# EAGLE design drv8353 based bldc power stage (EAGLE 9.5.0)

## Sheet 1 of 3: Gate Driver & Signal Headers
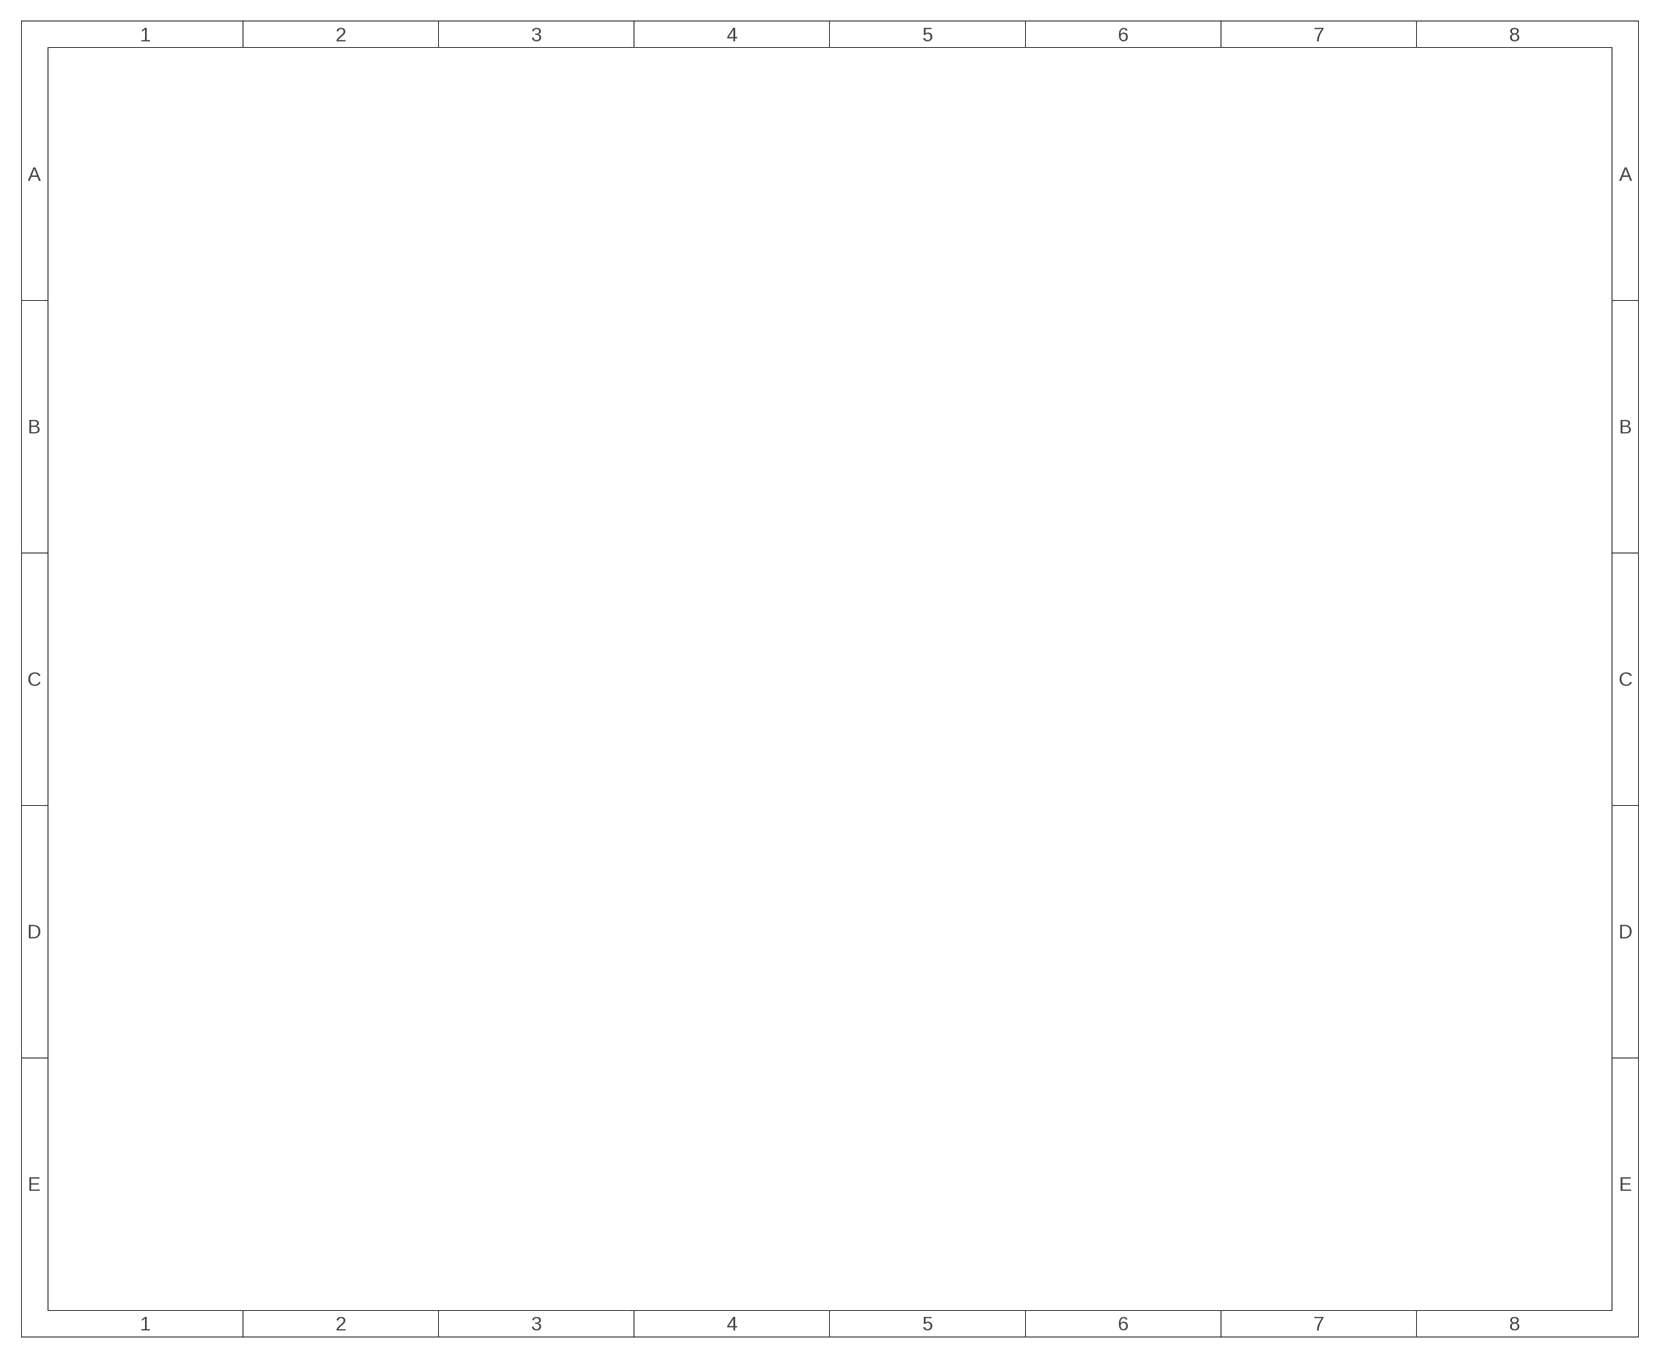
[diagram p0: schematic, sheet 1]

## Sheet 2 of 3: Half Bridges
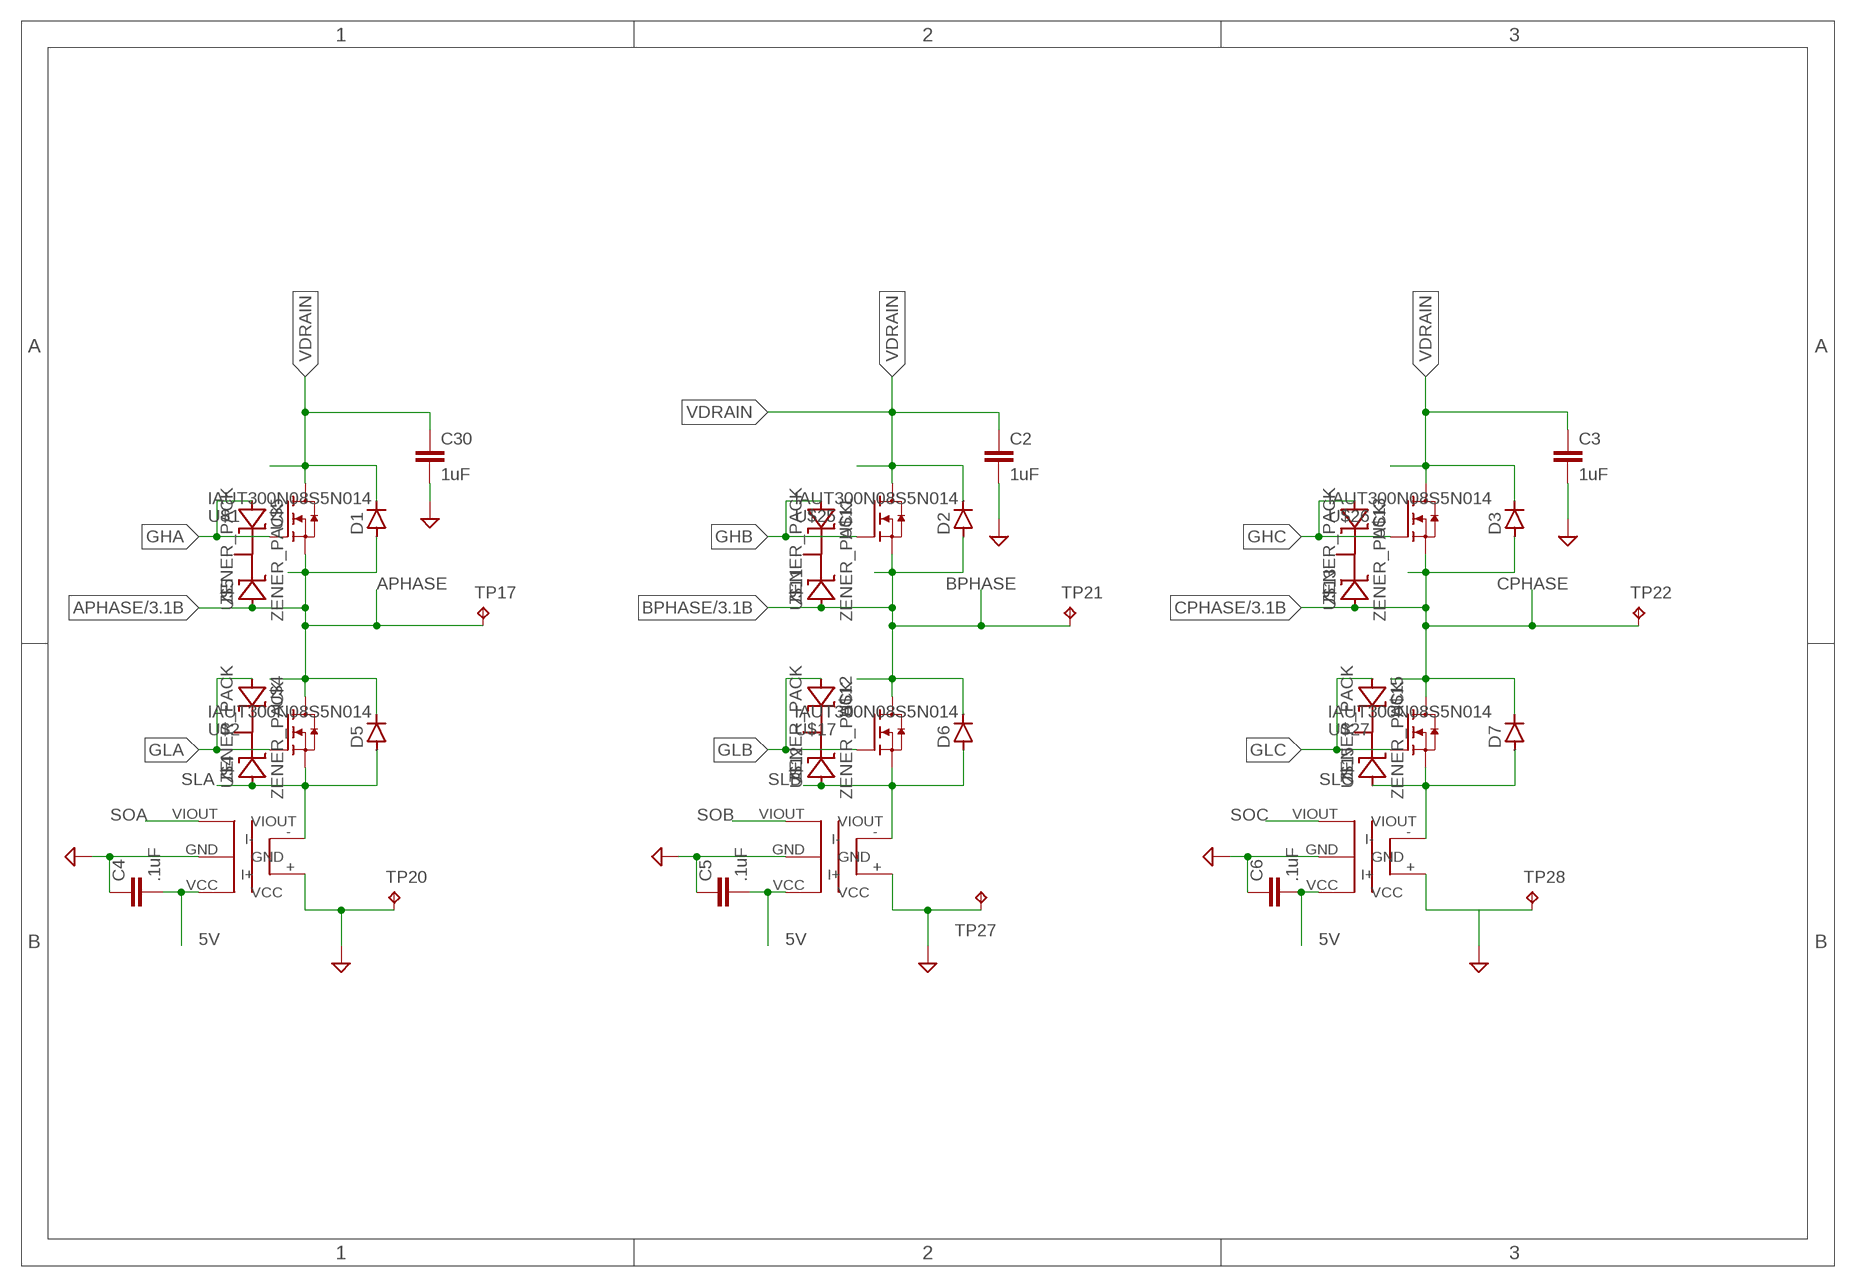
[diagram p1: schematic, sheet 2]

### Parts
C2  1uF  C-EUC1206  [C1206]
C3  1uF  C-EUC1206  [C1206]
C4  .1uF  C-EUC0603K  [C0603K]
C5  .1uF  C-EUC0603K  [C0603K]
C6  .1uF  C-EUC0603K  [C0603K]
C30  1uF  C-EUC1206  [C1206]
D1  D-SOD123  [SOD123]
D2  D-SOD123  [SOD123]
D3  D-SOD123  [SOD123]
D5  D-SOD123  [SOD123]
D6  D-SOD123  [SOD123]
D7  D-SOD123  [SOD123]
TP17  TPB1,27  [B1,27]
TP20  TPB1,27  [B1,27]
TP21  TPB1,27  [B1,27]
TP22  TPB1,27  [B1,27]
TP27  TPB1,27  [B1,27]
TP28  TPB1,27  [B1,27]
U$1  IAUT300N08S5N014  [PG-HSOF-8-1_MODIFIED]
U$2  IAUT300N08S5N014  [PG-HSOF-8-1_MODIFIED]
U$3  ACS770LCB-050B-PFF-T  [LEADFORM_PFF]
U$4  ZENER_PACK  [SOT23]
U$5  ZENER_PACK  [SOT23]
U$9  ACS770LCB-050B-PFF-T  [LEADFORM_PFF]
U$10  ACS770LCB-050B-PFF-T  [LEADFORM_PFF]
U$11  ZENER_PACK  [SOT23]
U$12  ZENER_PACK  [SOT23]
U$13  ZENER_PACK  [SOT23]
U$15  ZENER_PACK  [SOT23]
U$17  IAUT300N08S5N014  [PG-HSOF-8-1_MODIFIED]
U$25  IAUT300N08S5N014  [PG-HSOF-8-1_MODIFIED]
U$26  IAUT300N08S5N014  [PG-HSOF-8-1_MODIFIED]
U$27  IAUT300N08S5N014  [PG-HSOF-8-1_MODIFIED]

### Nets
5V: C4.2 C5.2 C6.2 U$3.VCC U$9.VCC U$10.VCC ; also sheet 3
APHASE: D1.2(A) D5.LINE(C) TP17.TP U$1.2(S) U$1.3(S) U$1.4(S) U$1.5(S) U$1.6(S) U$1.7(S) U$1.8(S) U$1.10(S) U$1.11(S) U$1.12(S) U$1.13(S) U$1.14(S) U$1.15(S) U$2.9(D) U$2.16(D) U$2.17(D) U$2.18(D) U$2.19(D) U$5.1(END1) ; also sheet 3
BPHASE: D2.2(A) D6.LINE(C) TP21.TP U$11.1(END1) U$17.9(D) U$17.16(D) U$17.17(D) U$17.18(D) U$17.19(D) U$25.2(S) U$25.3(S) U$25.4(S) U$25.5(S) U$25.6(S) U$25.7(S) U$25.8(S) U$25.10(S) U$25.11(S) U$25.12(S) U$25.13(S) U$25.14(S) U$25.15(S) ; also sheet 3
CPHASE: D3.2(A) D7.LINE(C) TP22.TP U$13.1(END1) U$26.2(S) U$26.3(S) U$26.4(S) U$26.5(S) U$26.6(S) U$26.7(S) U$26.8(S) U$26.10(S) U$26.11(S) U$26.12(S) U$26.13(S) U$26.14(S) U$26.15(S) U$27.9(D) U$27.16(D) U$27.17(D) U$27.18(D) U$27.19(D) ; also sheet 3
GHA: U$1.1(G) U$5.2(END2) ; also sheet 3
GHB: U$11.2(END2) U$25.1(G) ; also sheet 3
GHC: U$13.2(END2) U$26.1(G) ; also sheet 3
GLA: U$2.1(G) U$4.2(END2) ; also sheet 3
GLB: U$12.2(END2) U$17.1(G) ; also sheet 3
GLC: U$15.2(END2) U$27.1(G) ; also sheet 3
GND: C2.2 C3.2 C4.1 C5.1 C6.1 C30.2 TP20.TP TP27.TP TP28.TP U$3.+(I+) U$3.GND U$9.+(I+) U$9.GND U$10.+(I+) U$10.GND ; also sheet 3
SLA: D5.2(A) U$2.2(S) U$2.3(S) U$2.4(S) U$2.5(S) U$2.6(S) U$2.7(S) U$2.8(S) U$2.10(S) U$2.11(S) U$2.12(S) U$2.13(S) U$2.14(S) U$2.15(S) U$3.-(I-) U$4.1(END1) ; also sheet 3
SLB: D6.2(A) U$9.-(I-) U$12.1(END1) U$17.2(S) U$17.3(S) U$17.4(S) U$17.5(S) U$17.6(S) U$17.7(S) U$17.8(S) U$17.10(S) U$17.11(S) U$17.12(S) U$17.13(S) U$17.14(S) U$17.15(S) ; also sheet 3
SLC: D7.2(A) U$10.-(I-) U$15.1(END1) U$27.2(S) U$27.3(S) U$27.4(S) U$27.5(S) U$27.6(S) U$27.7(S) U$27.8(S) U$27.10(S) U$27.11(S) U$27.12(S) U$27.13(S) U$27.14(S) U$27.15(S) ; also sheet 3
SOA: U$3.VIOUT ; also sheet 3
SOB: U$9.VIOUT ; also sheet 3
SOC: U$10.VIOUT ; also sheet 3
VDRAIN [vdrain]: C2.1 C3.1 C30.1 D1.LINE(C) D2.LINE(C) D3.LINE(C) U$1.9(D) U$1.16(D) U$1.17(D) U$1.18(D) U$1.19(D) U$25.9(D) U$25.16(D) U$25.17(D) U$25.18(D) U$25.19(D) U$26.9(D) U$26.16(D) U$26.17(D) U$26.18(D) U$26.19(D) ; also sheet 3
Unconnected: U$4.3(MIDDLE) U$5.3(MIDDLE) U$11.3(MIDDLE) U$12.3(MIDDLE) U$13.3(MIDDLE) U$15.3(MIDDLE)

## Sheet 3 of 3: Power Connections / Converters
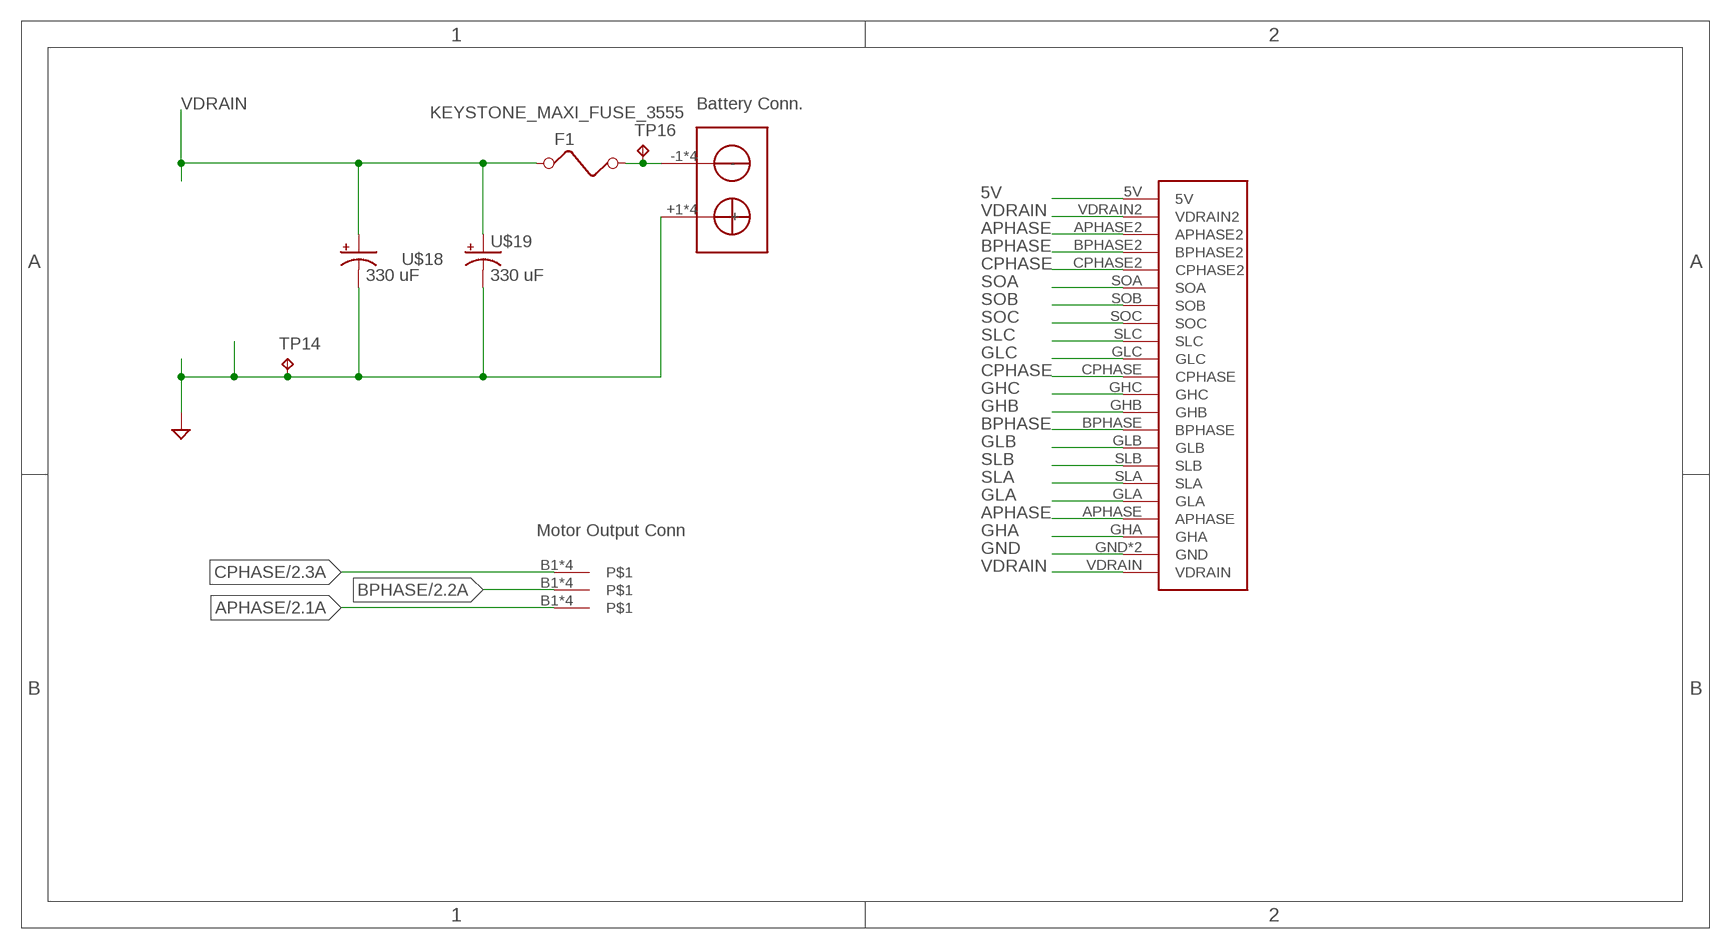
[diagram p2: schematic, sheet 3]

### Parts
F1  KEYSTONE_MAXI_FUSE_3555  [KEYSTONE_MAXI_FUSE_CLIP_3555]
TP14  TPB1,27  [B1,27]
TP16  TPB1,27  [B1,27]
U$6  MINI-PP75  [MINI-PP75]
U$7  MINI-PP75  [MINI-PP75]
U$8  MINI-PP75  [MINI-PP75]
U$14  POWER_STAGE_CONNECTOR  [POWER_STAGE_CONNECTION]
U$16  SB50  [MINI-SB-50]
U$18  330 uF  RADIALK16  [SM_RADIAL_K16_1PRIMARY]
U$19  330 uF  RADIALK16  [SM_RADIAL_K16_1PRIMARY]

### Nets
5V: U$14.5V ; also sheet 2
APHASE: U$8.B1 U$8.B2 U$8.B3 U$8.B4 U$14.APHASE U$14.APHASE2 ; also sheet 2
BPHASE: U$7.B1 U$7.B2 U$7.B3 U$7.B4 U$14.BPHASE U$14.BPHASE2 ; also sheet 2
CPHASE: U$6.B1 U$6.B2 U$6.B3 U$6.B4 U$14.CPHASE U$14.CPHASE2 ; also sheet 2
GHA: U$14.GHA ; also sheet 2
GHB: U$14.GHB ; also sheet 2
GHC: U$14.GHC ; also sheet 2
GLA: U$14.GLA ; also sheet 2
GLB: U$14.GLB ; also sheet 2
GLC: U$14.GLC ; also sheet 2
GND: TP14.TP U$14.GND U$14.GND2(GND) U$16.+1(+) U$16.+2(+) U$16.+3(+) U$16.+4(+) U$18.- U$19.- ; also sheet 2
N$15: F1.B1 F1.B2 TP16.TP U$16.-1(-) U$16.-2(-) U$16.-3(-) U$16.-4(-)
SLA: U$14.SLA ; also sheet 2
SLB: U$14.SLB ; also sheet 2
SLC: U$14.SLC ; also sheet 2
SOA: U$14.SOA ; also sheet 2
SOB: U$14.SOB ; also sheet 2
SOC: U$14.SOC ; also sheet 2
VDRAIN [vdrain]: F1.A1 F1.A2 U$14.VDRAIN U$14.VDRAIN2 U$18.+ U$19.+ ; also sheet 2

### Notes on the sheet
- Battery Conn.
- Motor Output Conn

## Library data of the parts
C2-C6 C30 = rcl:C-EU: CAPACITOR, European symbol; SPICEPREFIX: C
D1-D3 D5-D7 = REV BLDC:D-: DIODE unfilled
F1 = REV BLDC:KEYSTONE_MAXI_FUSE_3555
TP14 TP16 TP17 TP20-TP22 TP27 TP28 = testpad:TP: Test pad
U$1 U$2 U$17 U$25-U$27 = SamacSys_Parts:IAUT300N08S5N014
U$3 U$9 U$10 = REV BLDC:ACS770LCB-050B-PFF-T
U$4 U$5 U$11-U$13 U$15 = REV BLDC:ZENER_PACK
U$6-U$8 = REV BLDC:MINI-PP75
U$14 = REV BLDC:POWER_STAGE_CONNECTOR
U$16 = REV BLDC:SB50
U$18 U$19 = REV BLDC:RADIALK16

## Net classes
1 vdrain: clearance 0.2 mm

## Board
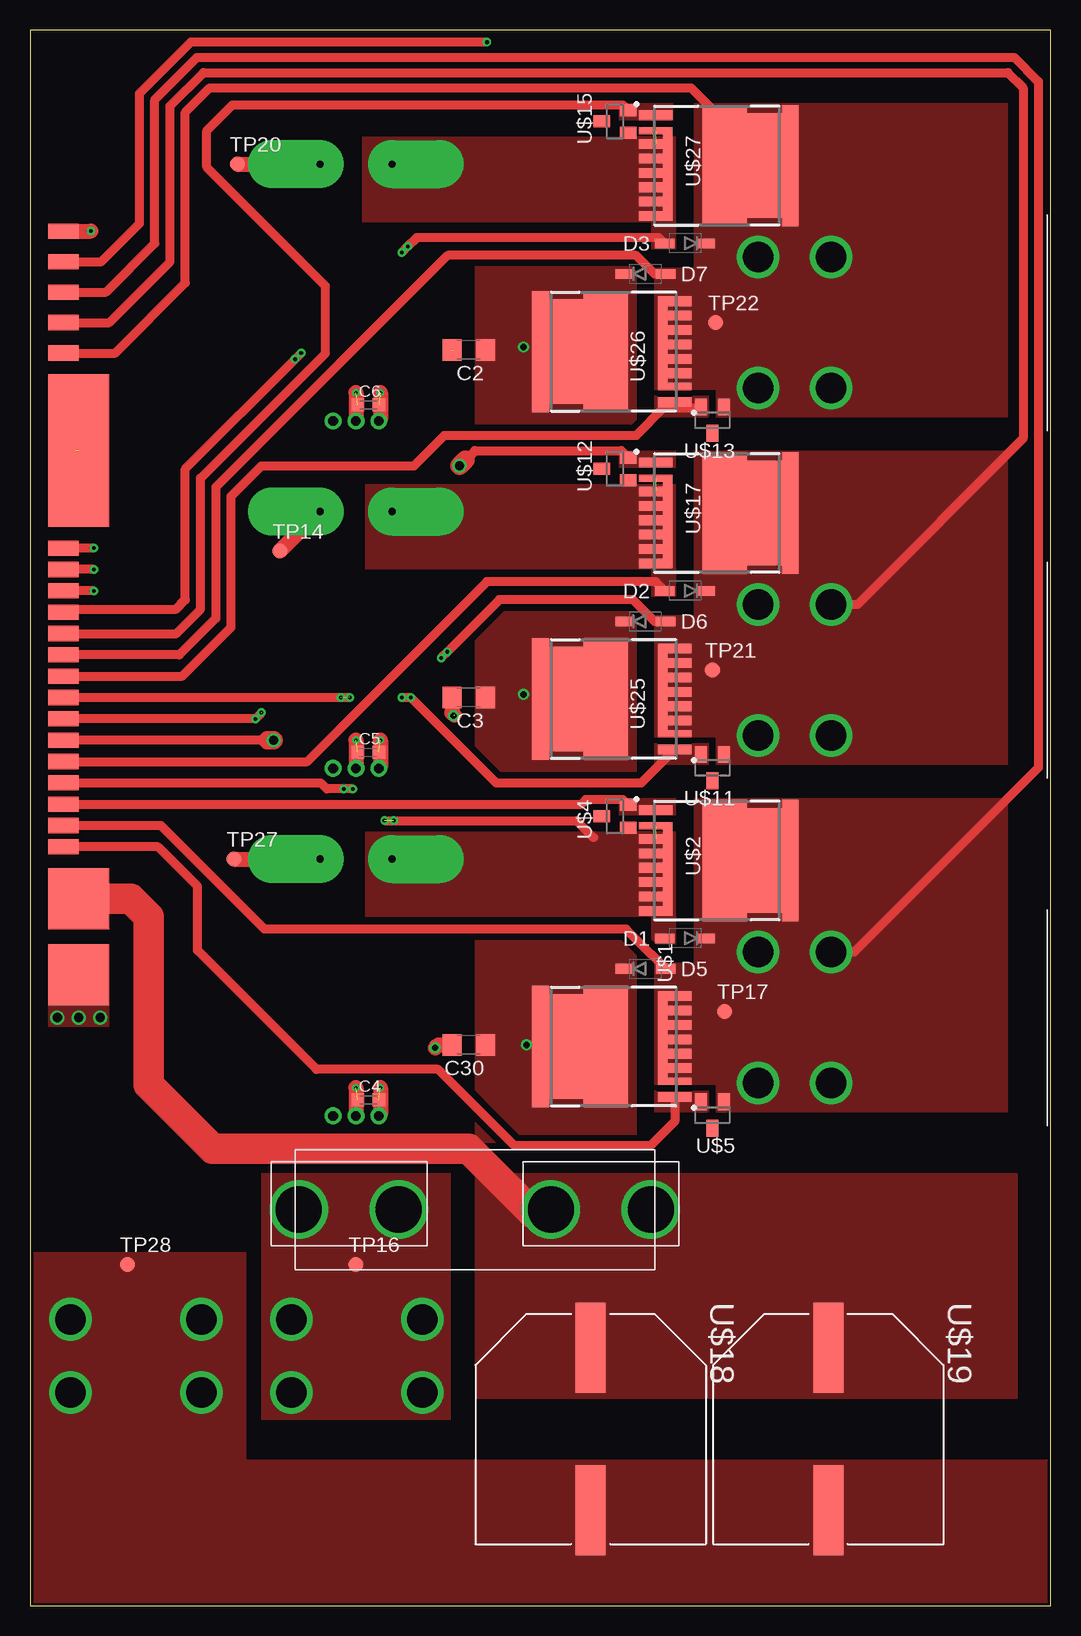
[diagram p3: board, top side]
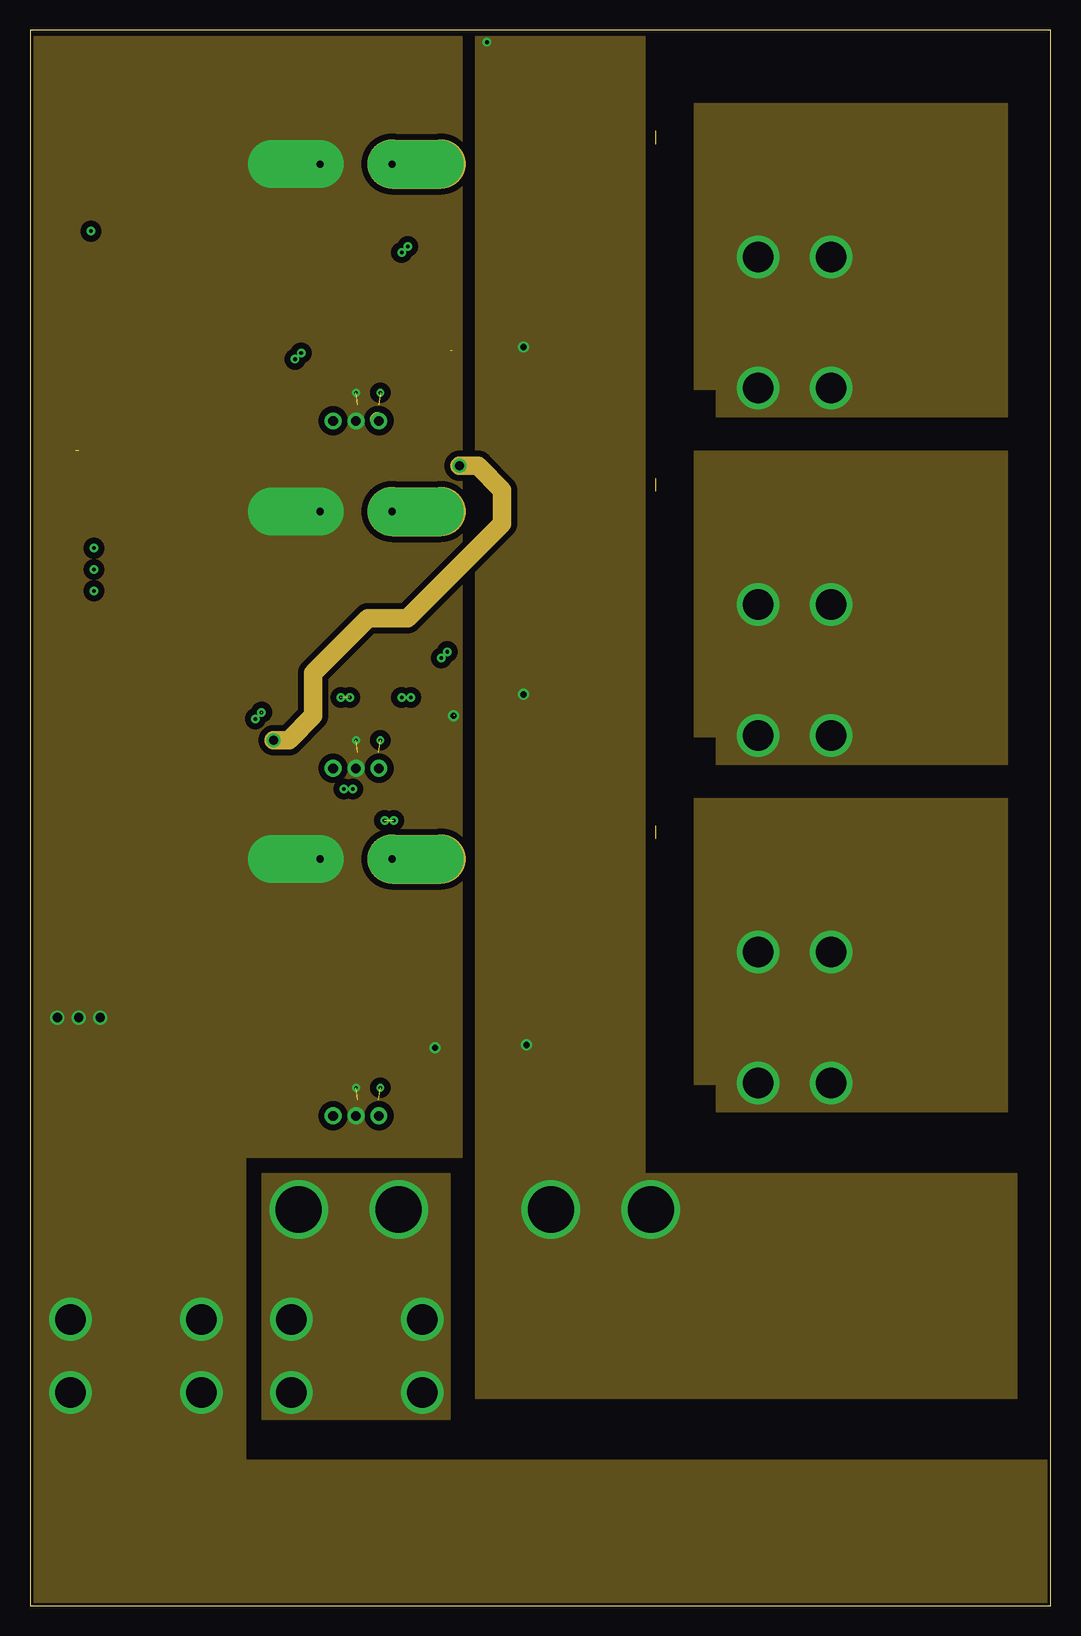
[diagram p4: board, inner layer Route2]
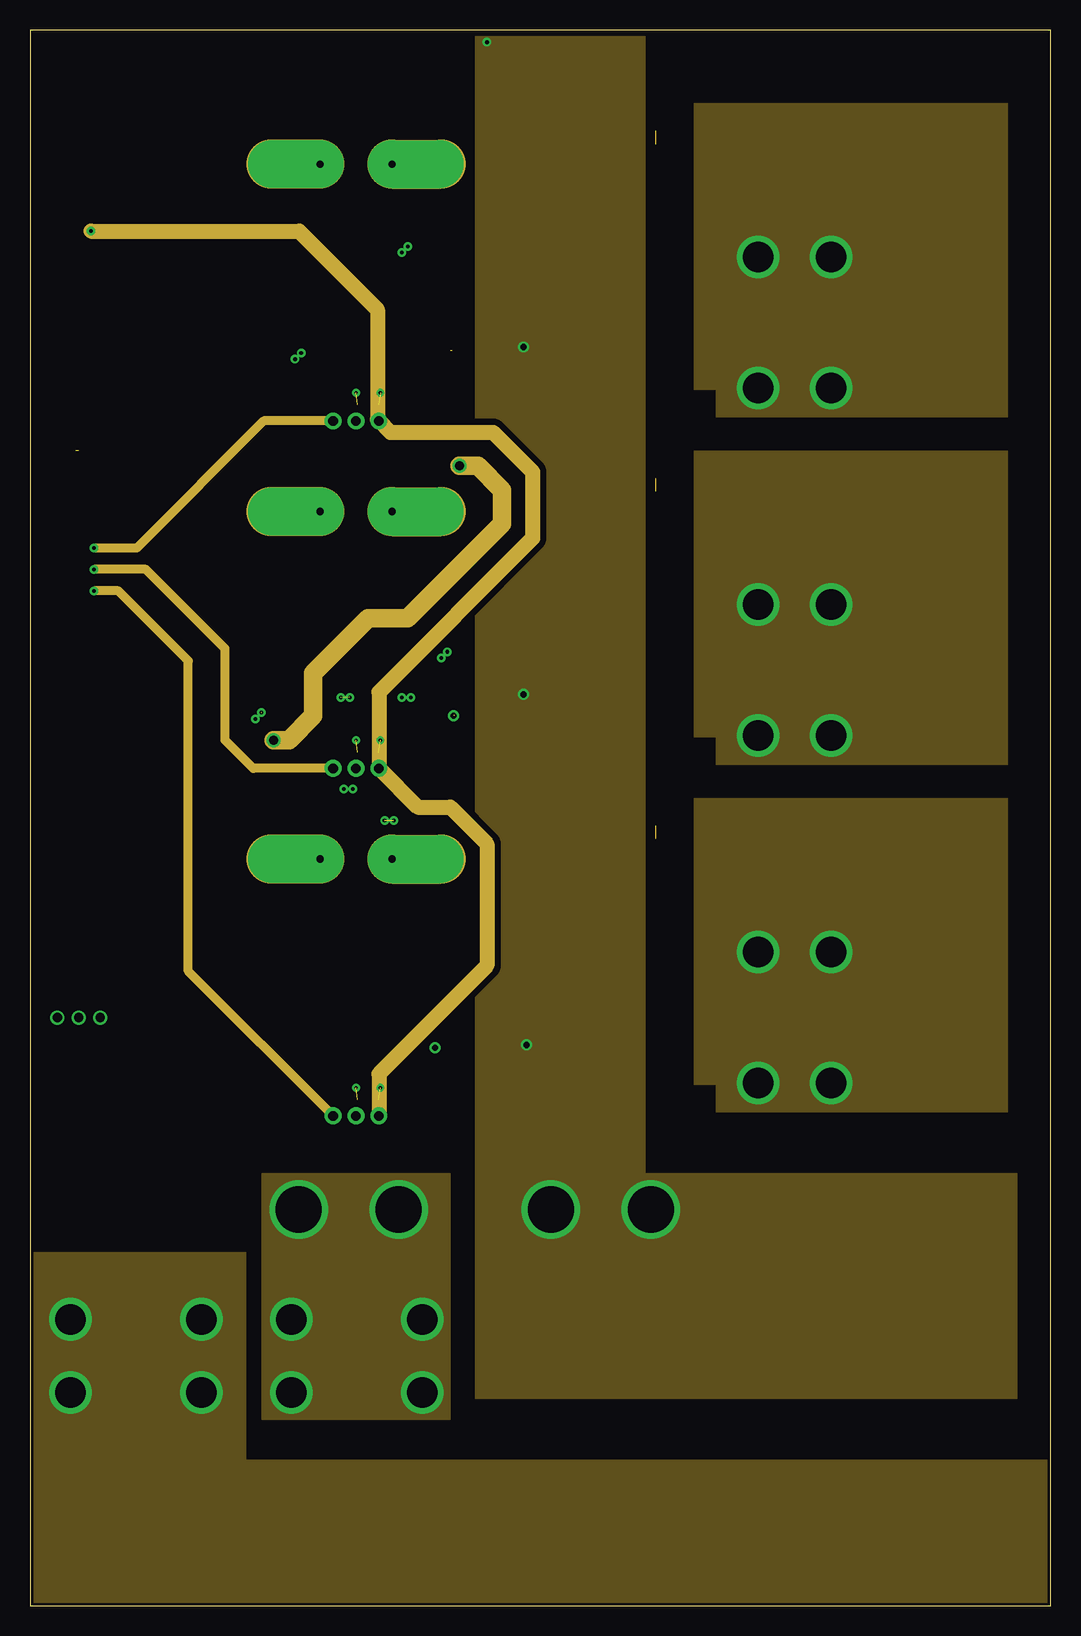
[diagram p5: board, inner layer Route15]
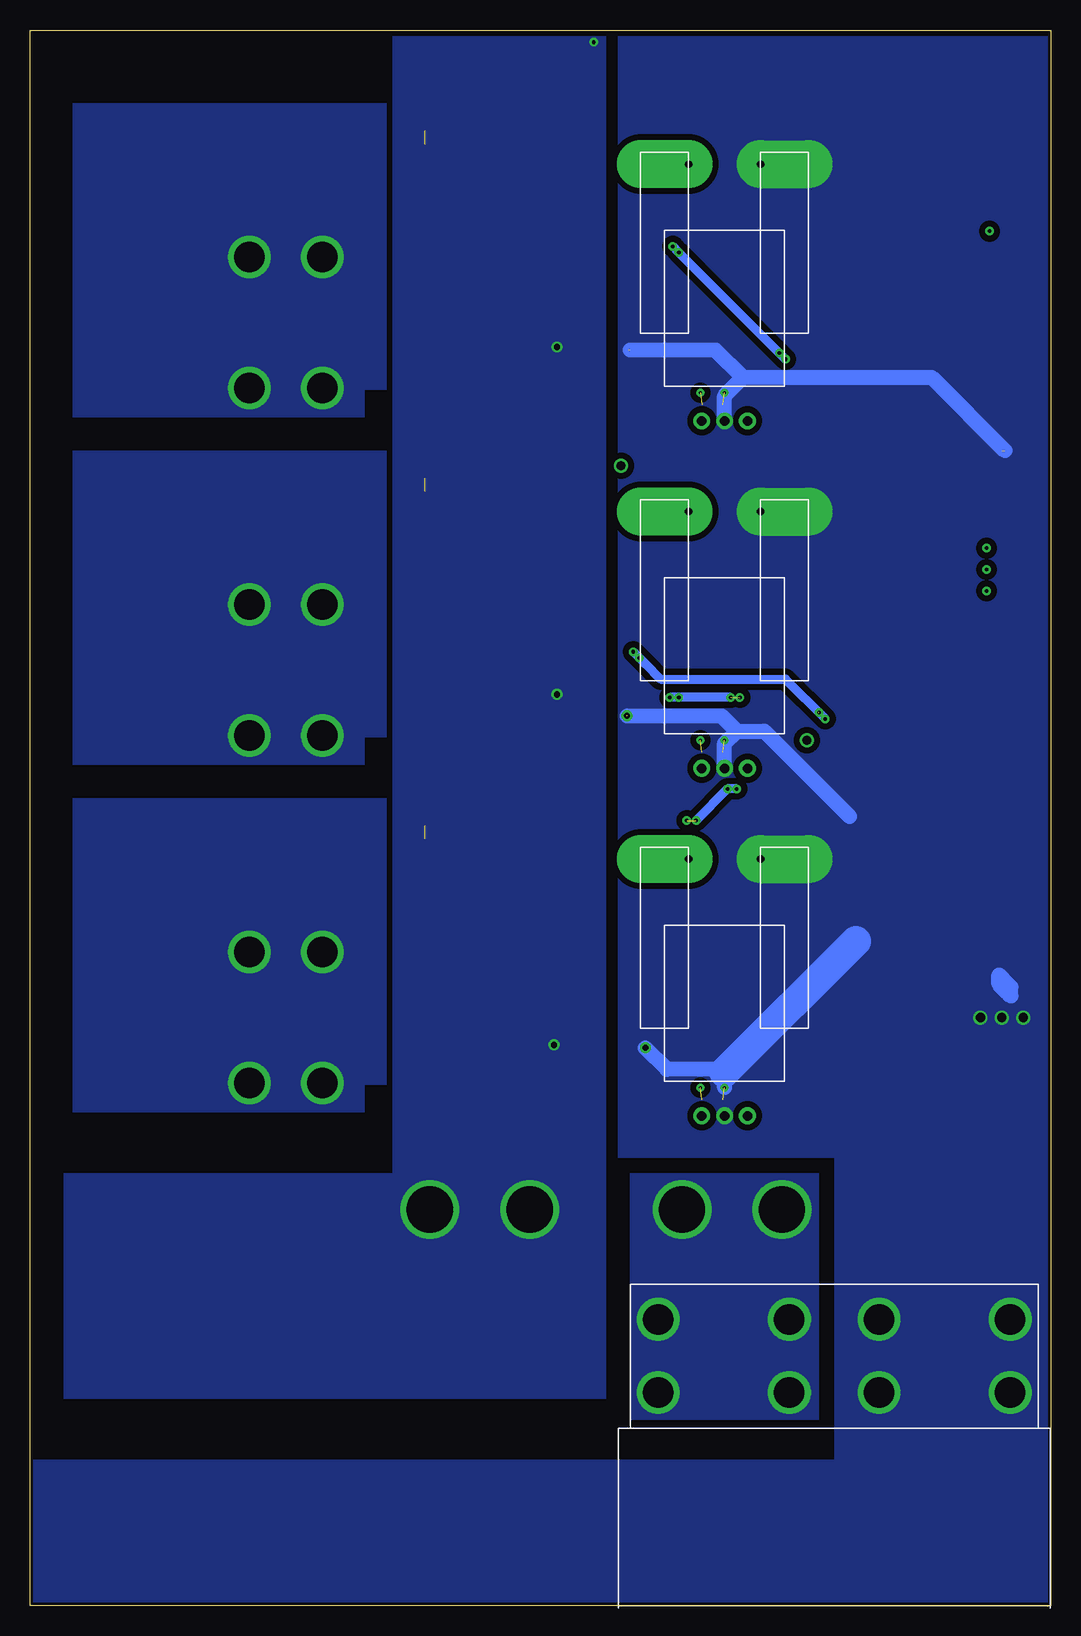
[diagram p6: board, bottom side, seen from below]

Size 85.09 x 131.32 mm. Coordinates in mm from the lower left corner, seen from the top.
Outline: 0,0 85.09,0 85.09,131.32 0,131.32 0,0
Copper layers (1+2*15+16): Top 0.07mm / dielectric 0.1mm / Route2 0.0175mm / dielectric 0.995mm / Route15 0.0175mm / dielectric 0.1mm / Bottom 0.07mm
Design rules "default *": minimum track width 6mil, minimum drill 0.3mm, track to track 20mil, track to pad 20mil, pad to pad 20mil, via to via 20mil, smd to smd 0mil, copper to edge 10mil, drill to drill 6mil, minimum pad ring 10mil, minimum via ring 8mil, stop-mask expansion 4mil, vias tented up to drill 0mil, thermal gap 10mil

### Footprints (pad centres in the part's own frame; a part is rotated, then mirrored left to right if it is on the bottom)
C1206 = smd 1.6 x 1.8: 1 -1.4,0; 2 1.4,0
C0603K = smd 1.05 x 1.08: 1 -0.875,0; 2 0.875,0
SOD123 = smd 1.6 x 0.8: 2 1.7,0; LINE -1.7,0
KEYSTONE_MAXI_FUSE_CLIP_3555 = drill 3.861: A1 -14.681,0; A2 -6.35,0; B1 6.35,0; B2 14.681,0
B1,27 = smd 1.27 x 1.27: TP 0,0
PG-HSOF-8-1_MODIFIED = smd 0.8 x 2.8: 1 0.75,0.098; 3 3.15,0.098; 4 4.35,0.098; 5 5.55,0.098; 6 6.75,0.098; 7 7.95,0.098; 8 9.15,0.098 | smd 0.5 x 0.8: 2 2.55,1.098; 11 3.75,1.098; 12 4.95,1.098; 13 6.15,1.098; 14 7.35,1.098; 15 8.55,1.098 | smd 8.7 x 8: 9 4.95,7.998 | smd 0.6 x 2.8: 10 2.05,0.098 | smd 0.7 x 3.7: 16 0.25,5.848; 17 9.65,5.848 | smd 0.7 x 1.4: 18 0.25,11.298; 19 9.65,11.298
LEADFORM_PFF = drill 0.6 pad 4 offset: + 3,0; - -3,0 | drill 0.8 pad 1.4: GND 0,-21.4; VCC -1.91,-21.4; VIOUT 1.91,-21.4
SOT23 = smd 1 x 1.4: 1 -0.95,-1.1; 2 0.95,-1.1; 3 0,1.1
MINI-PP75 = drill 2.53: B1 -6.1,-5.46; B2 0,-5.46; B3 -6.1,5.46; B4 0,5.46
POWER_STAGE_CONNECTION = smd 2.54 x 1.27: 5V 1.27,52.07; APHASE 1.27,2.54; APHASE2 1.27,46.99; BPHASE 1.27,11.43; BPHASE2 1.27,44.45; CPHASE 1.27,16.764; CPHASE2 1.27,41.91; GHA 1.27,0.762; GHB 1.27,13.208; GHC 1.27,14.986; GLA 1.27,4.318; GLB 1.27,9.652; GLC 1.27,18.542; SLA 1.27,6.096; SLB 1.27,7.874; SLC 1.27,20.32; SOA 1.27,22.098; SOB 1.27,23.876; SOC 1.27,25.654; VDRAIN2 1.27,49.53 | smd 5.08 x 5.08: GND 2.54,-9.906; VDRAIN 2.54,-3.556 | smd 5.08 x 12.7: GND2 2.54,33.782
MINI-SB-50 = drill 2.54: +1 -6.096,14.668; +2 0,14.668; +3 -6.096,3.747; +4 0,3.747; -1 -6.096,-3.747; -2 0,-3.747; -3 -6.096,-14.668; -4 0,-14.668
SM_RADIAL_K16_1PRIMARY = smd 7.493 x 2.489: + -6.756,0; - 6.756,0

### Placement (x,y rotation side)
C2  36.58,104.65 180 top
C3  36.58,75.69 180 top
C4  28.19,42.16 0 top
C5  28.19,71.12 0 top
C6  28.19,100.08 0 top
C30  36.58,46.74 180 top
D1  51.31,53.09 0 top
D2  51.31,82.04 0 top
D3  51.31,111 0 top
D5  54.61,55.63 180 top
D6  54.61,84.58 180 top
D7  54.61,113.54 180 top
F1  37.08,33.02 180 top
TP14  20.83,87.88 0 top
TP16  27.18,28.45 0 top
TP17  57.91,49.53 0 top
TP20  17.27,120.14 0 top
TP21  56.9,77.98 0 top
TP22  57.15,106.93 0 top
TP27  17.02,62.23 0 top
TP28  8.13,28.45 0 top
U$1  53.85,41.66 90 top
U$2  52.07,67.06 270 top
U$3  27.18,62.23 0 bottom
U$4  48.77,65.79 90 top
U$5  56.9,40.89 180 top
U$6  66.8,106.93 0 top
U$7  66.8,77.98 0 top
U$8  66.8,49.02 0 top
U$9  27.18,91.19 0 bottom
U$10  27.18,120.14 0 bottom
U$11  56.9,69.85 180 top
U$12  48.77,94.74 90 top
U$13  56.9,98.81 180 top
U$14  1.52,62.48 0 top
U$15  48.77,123.7 90 top
U$16  18.03,17.78 270 bottom
U$17  52.07,96.01 270 top
U$18  46.74,14.73 270 top
U$19  66.55,14.73 270 top
U$25  53.85,70.61 90 top
U$26  53.85,99.57 90 top
U$27  52.07,124.97 270 top

### Tracks (layer width: path | path; a pad name or v marks a point on that pad's centre or on a via)
5V  (via drill 0.25, 0.3, 0.51)  (3 unrouted)
  Top 1.27: U$14.5V v5.08,114.55 | v29.21,43.18 29.21,40.95 U$3.VCC | v29.21,72.14 29.21,69.91 U$9.VCC | v29.21,101.09 29.21,98.86 U$10.VCC
  Route2 1.27: v28.98,98.86 U$10.VCC
  Route15 1.27: v5.08,114.55 22.44,114.55 28.98,108.02 v28.98,98.86 | U$10.VCC 30.04,97.79 38.61,97.79 41.91,94.49 41.91,88.96 29.09,76.14 U$9.VCC 32.33,66.55 35.05,66.55 38.1,63.5 38.1,53.34 29.09,44.33 U$3.VCC
APHASE
  Top 0.762: D1.2 51.76,54.34 51.74,54.34 49.69,56.39 19.56,56.39 10.92,65.02 U$14.APHASE | U$14.APHASE2 6.35,109.47 10.41,113.54 10.41,125.51 13.93,129.03 82.06,129.03 84.07,127.02 84.07,69.85 68.71,54.48 U$8.B4
  pour Top (no thermals): 55.37,67.31 55.37,43.43 81.53,43.43 81.53,67.31
  pour Top: 52.07,51.56 52.07,43.43 56.9,43.43 56.9,51.56
  pour Top (no thermals): 57.2,41.15 81.53,41.15 81.53,45.72 57.2,45.72
  pour Top: 52.07,50.8 52.07,53.59 56.64,53.59 56.64,50.8
  pour Bottom: 81.53,67.31 55.37,67.31 55.37,43.43 81.53,43.43
  pour Route15: 81.53,67.31 55.37,67.31 55.37,43.43 81.53,43.43
  pour Route2: 81.53,67.31 55.37,67.31 55.37,43.43 81.53,43.43
  pour Bottom: 57.2,41.15 57.2,45.21 81.53,45.21 81.53,41.15
  pour Route15: 57.2,41.15 57.2,45.21 81.53,45.21 81.53,41.15
  pour Route2: 57.2,41.15 57.2,45.21 81.53,45.21 81.53,41.15
BPHASE  (via drill 0.3)  (1 unrouted)
  Top 0.762: D2.2 52.06,82.04 50.27,83.84 39.13,83.84 v34.8,79.5 v34.29,78.99 | U$14.BPHASE v18.8,73.91 18.8,73.92 19.3,74.43 | U$14.BPHASE2 6.6,106.93 11.68,112.01 11.68,124.99 14.46,127.76 81.53,127.76 82.8,126.49 82.8,97.28 68.96,83.44 U$7.B4
  Bottom 0.762: v18.8,73.91 22.1,77.22 32.51,77.22 33.78,78.49 v34.29,78.99 v34.8,79.5
  other vias: 19.3,74.45
  pour Top (no thermals): 55.37,96.27 55.37,72.39 81.53,72.39 81.53,96.27
  pour Top: 52.07,82.55 52.07,72.39 56.13,72.39 56.13,82.55
  pour Top (no thermals): 57.2,70.1 81.53,70.1 81.53,73.91 57.2,73.91
  pour Bottom: 81.53,96.27 55.37,96.27 55.37,72.39 81.53,72.39
  pour Route15: 81.53,96.27 55.37,96.27 55.37,72.39 81.53,72.39
  pour Route2: 81.53,96.27 55.37,96.27 55.37,72.39 81.53,72.39
  pour Bottom: 57.2,70.1 57.2,74.17 81.53,74.17 81.53,70.1
  pour Route15: 57.2,70.1 57.2,74.17 81.53,74.17 81.53,70.1
  pour Route2: 57.2,70.1 57.2,74.17 81.53,74.17 81.53,70.1
CPHASE
  Top 0.762: D3.2 52.06,111 50.52,112.54 34.82,112.54 15.49,93.22 15.49,82.3 12.45,79.25 U$14.CPHASE | U$14.CPHASE2 7.11,104.39 12.95,110.24 12.95,124.46 14.99,126.49 55.12,126.49 56.9,124.71 56.9,124.21
  pour Top (no thermals): 55.37,125.22 55.37,101.35 81.53,101.35 81.53,125.22
  pour Top: 52.07,111.51 52.07,101.35 56.13,101.35 56.13,111.51
  pour Top (no thermals): 57.2,99.06 81.53,99.06 81.53,102.87 57.2,102.87
  pour Bottom: 81.53,125.22 55.37,125.22 55.37,101.35 81.53,101.35
  pour Route15: 81.53,125.22 55.37,125.22 55.37,101.35 81.53,101.35
  pour Route15: 57.2,99.06 57.2,103.63 81.53,103.63 81.53,99.06
  pour Route2: 57.2,99.06 57.2,103.63 81.53,103.63 81.53,99.06
  pour Bottom: 57.2,99.06 57.2,103.12 81.53,103.12 81.53,99.06
  pour Route2: 81.53,125.22 55.37,125.22 55.37,101.35 81.53,101.35
GHA
  Top 0.762: U$1.1 53.75,40.37 51.73,38.35 40.39,38.35 34.04,44.7 23.88,44.7 13.97,54.61 13.97,59.94 10.67,63.25 U$14.GHA
  pour Top (no thermals): 52.07,42.93 56.59,42.93 56.59,41.15 52.07,41.15
GHB  (via drill 0.3)  (2 unrouted)
  Top 0.762: U$25.1 50.97,68.58 38.86,68.58 v31.75,75.69 v30.99,75.69 | U$14.GHB 2.8,75.7 v26.66,75.7
  Bottom 0.762: v26.66,75.7 v31.74,75.7 v31.75,75.69
  other vias: 25.91,75.69
  pour Top (no thermals): 52.07,71.88 56.59,71.88 56.59,70.1 52.07,70.1
GHC
  Top 0.762: U$14.GHC 12.7,77.47 16.76,81.53 16.76,92.46 19.3,95 32,95 34.54,97.54 50.55,97.54 52.83,99.82 55.86,99.82 U$13.2
  pour Top (no thermals): 52.07,100.84 52.07,99.06 56.59,99.06 56.59,100.84
GLA
  Top 0.762: U$14.GLA 45.97,66.8 46.35,67.17 49.43,67.17 U$4.2
  pour Top (no thermals): 49.1,67.31 49.1,65.86 53.85,65.86 53.85,67.31
GLB  (via drill 0.76)
  Top 0.762: U$12.2 49.29,96.27 37.08,96.27 36.32,95.5 | 19.81,72.14 U$14.GLB
  Top 1.524: v35.81,95 36.32,95.5 | v20.32,72.14 19.81,72.14
  Route2 1.524: v20.32,72.14 21.59,72.14 23.62,74.17 23.62,77.72 28.19,82.3 31.5,82.3 39.37,90.17 39.37,92.96 37.34,95 v35.81,95
  Route15 1.524: v35.81,95 37.34,95 39.37,92.96 39.37,90.17 31.5,82.3 28.19,82.3 23.62,77.72 23.62,74.17 21.59,72.14 v20.32,72.14
  pour Top (no thermals): 49.1,96.27 49.1,94.82 53.85,94.82 53.85,96.27
GLC
  Top 0.762: U$14.GLC 12.19,81.03 14.22,83.06 14.22,93.98 24.64,104.39 24.64,109.98 14.73,119.89 14.73,122.94 16.88,125.09 49.43,125.09 U$15.2
  pour Top (no thermals): 49.12,125.22 49.12,123.8 53.62,123.8 53.62,125.22
GND  (via drill 0.25, 0.51, 0.76)  (6 unrouted)
  Top 1.27: TP27.TP U$3.+ | TP14.TP 24.13,91.19 U$9.+ | TP20.TP U$10.+ | v33.78,46.49 34.02,46.74 C30.2 | v27.18,43.18 U$3.GND | v27.18,72.14 U$9.GND | v27.18,101.09 U$10.GND | C3.2 35.18,74.42 35.37,74.23
  Route15 4.064: U$3.+ 20.07,62.23 | U$9.+ 20.07,91.19 | U$10.+ 20.07,120.14
  Bottom 1.27: v27.18,43.18 27.18,44.45 | U$9.GND 27.18,71.88 26.16,72.9 | 26.16,72.9 23.88,72.9 16.76,65.79 | U$10.GND 27.18,100.84 25.65,102.36 | 3.56,51.05 3.3,50.8 3.3,51.56 3.56,51.82 | 3.81,96.27 9.91,102.36 25.65,102.36 | 3.56,51.82 3.56,51.05 | 3.56,51.82 4.32,52.58 4.32,51.82 3.56,51.05 | 26.92,44.7 32,44.7 v33.78,46.48 v33.78,46.49 | 25.65,102.36 27.94,104.65 35.05,104.65 | v35.31,74.17 27.43,74.17 26.16,72.9
  Bottom 2.54: 27.18,44.45 26.92,44.7 16.26,55.37
  other vias: 2.29,49.02 4.06,49.02 5.84,49.02
  pour Bottom (no thermals): 0.25,0.25 18.03,0.25 18.03,130.81 0.25,130.81
  pour Bottom (no thermals): 16.26,66.8 17.53,66.8 17.53,57.66 16.26,57.66
  pour Bottom (no thermals): 15.24,95.76 26.16,95.76 26.16,86.61 15.24,86.61
  pour Bottom (no thermals): 16,124.71 26.16,124.71 26.16,115.57 16,115.57
  pour Top (no thermals): 0.25,0.25 84.84,0.25 84.84,12.19 0.25,12.19
  pour Bottom (no thermals): 0.25,0.25 84.84,0.25 84.84,12.19 0.25,12.19
  pour Route15 (no thermals): 0.25,0.25 84.84,0.25 84.84,12.19 0.25,12.19
  pour Route2 (no thermals): 0.25,0.25 84.84,0.25 84.84,12.19 0.25,12.19
  pour Top (no thermals): 0.25,0.25 18.03,0.25 18.03,29.46 0.25,29.46
  pour Route2 (no thermals): 0.25,0.25 18.03,0.25 18.03,29.46 0.25,29.46
  pour Route15 (no thermals): 0.25,0.25 18.03,0.25 18.03,29.46 0.25,29.46
  pour Top (no thermals): 1.52,50.29 1.52,48.26 6.6,48.26 6.6,50.29
  pour Bottom (no thermals): 14.22,130.81 14.22,37.34 36.07,37.34 36.07,130.81
  pour Route2 (no thermals): 0.25,0.25 18.03,0.25 18.03,130.81 0.25,130.81
  pour Route2 (no thermals): 14.22,130.81 14.22,37.34 36.07,37.34 36.07,130.81
N$15
  pour Bottom: 19.3,36.07 19.3,15.49 35.05,15.49 35.05,36.07
  pour Route15: 19.3,36.07 19.3,15.49 35.05,15.49 35.05,36.07
  pour Route2: 19.3,36.07 19.3,15.49 35.05,15.49 35.05,36.07
  pour Top (no thermals): 19.3,36.07 19.3,15.49 35.05,15.49 35.05,36.07
SLA  (via drill 0.3)  (2 unrouted)
  Top 0.762: U$14.SLA 24.23,68.58 24.73,68.07 v26.92,68.07 | 46.99,64.01 45.56,65.43 v29.57,65.43
  Route2 4.064: U$3.- 34.29,62.23
  Route15 4.064: U$3.- 34.29,62.23
  Bottom 0.762: v26.16,68.07 v26.92,68.07 v29.56,65.43 v29.57,65.43
  other vias: 30.33,65.43
  pour Top (no thermals): 53.85,64.52 27.94,64.52 27.94,57.4 53.85,57.4
  pour Top: 51.82,55.12 51.82,57.91 53.85,57.91 53.85,55.12
  pour Top: 49.28,65.28 49.28,64.01 50.55,64.01 50.55,65.28 49.53,65.28
SLB  (1 unrouted)
  Top 0.762: U$14.SLB 23.11,70.36 38.1,85.34 52.15,85.34 D6.2
  Route2 4.064: U$9.- 34.29,91.19
  Route15 4.064: U$9.- 34.29,91.19
  pour Top (no thermals): 53.85,93.47 27.94,93.47 27.94,86.36 53.85,86.36
  pour Top: 49.28,93.22 49.28,94.23 50.55,94.23 50.55,93.22
  pour Top: 51.82,84.07 51.82,86.87 53.85,86.87 53.85,84.07
SLC  (via drill 0.3)  (1 unrouted)
  Top 0.762: U$14.SLC 3.05,83.06 12.19,83.06 12.95,83.82 12.95,94.74 v22.1,103.89 v22.61,104.39 | D7.2 52.4,114.05 32.26,114.05 v31.5,113.28 v30.99,112.78
  Route2 4.064: U$10.- 34.29,120.14
  Route15 4.064: U$10.- 34.29,120.14
  Bottom 0.762: v22.1,103.89 v22.61,104.39 v30.99,112.78 v31.5,113.28
  pour Top (no thermals): 53.85,122.43 27.69,122.43 27.69,115.32 53.85,115.32
  pour Top: 49.28,123.19 49.28,121.67 50.55,121.67 50.55,123.19
  pour Top: 51.82,113.03 51.82,115.82 53.85,115.82 53.85,113.03
SOA  (via drill 0.3)
  Top 0.762: v5.33,84.58 U$14.SOA
  Route15 0.762: U$3.VIOUT 13.21,52.89 13.21,78.74 7.37,84.58 v5.33,84.58
SOB  (via drill 0.3)
  Top 0.762: v5.33,86.36 U$14.SOB
  Route15 0.762: U$9.VIOUT 18.61,69.79 16.26,72.14 16.26,79.76 9.65,86.36 v5.33,86.36
SOC  (via drill 0.3)
  Top 0.762: v5.33,88.14 U$14.SOC
  Route15 0.762: U$10.VIOUT 19.49,98.74 8.89,88.14 v5.33,88.14
VDRAIN  (via drill 0.3, 0.51)
  Top 0.762: U$14.VDRAIN2 5.96,112.01 9.14,115.2 9.14,126.04 13.41,130.3 v38.1,130.3
  Top 2.54: U$14.VDRAIN 8.38,58.93 9.91,57.4 9.91,43.43 15.24,38.1 36.58,38.1 41.91,32.77
  other vias: 41.15,75.95 41.15,104.9 41.4,46.74
  pour Top (no thermals): 37.08,17.27 82.3,17.27 82.3,36.07 37.08,36.07
  pour Bottom (no thermals): 37.08,17.27 82.3,17.27 82.3,36.07 37.08,36.07
  pour Route15 (no thermals): 37.08,17.27 82.3,17.27 82.3,36.07 37.08,36.07
  pour Route2 (no thermals): 37.08,17.27 82.3,17.27 82.3,36.07 37.08,36.07
  pour Bottom: 37.08,30.48 54.86,30.48 54.86,130.81 37.08,130.81
  pour Top (no thermals): 37.08,112.27 50.55,112.27 50.55,97.79 37.08,97.79
  pour Top (no thermals): 37.08,83.06 50.55,83.06 50.55,68.58 37.08,68.58
  pour Top (no thermals): 37.08,56.13 50.55,56.13 50.55,38.61 37.08,38.61
  pour Route15: 37.08,30.48 51.31,30.48 51.31,130.81 37.08,130.81
  pour Route2: 37.08,30.48 51.31,30.48 51.31,130.81 37.08,130.81